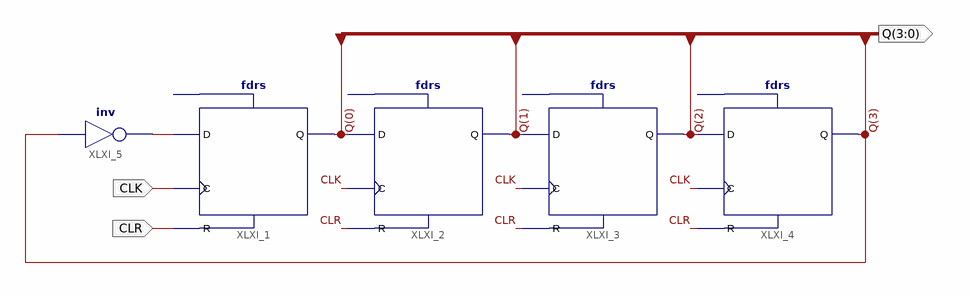
[diagram p0: schematic sheet 1]
// Xilinx ISE schematic Lab7_Ex8.sch (spartan3e) as structural Verilog: 5 symbols, 3 ports
module Lab7_Ex8 (
  input  CLK,
  input  CLR,
  output [3:0] Q
);

  wire XLXN_16;

  fdrs XLXI_1 (.C(CLK), .D(XLXN_16), .R(CLR), .Q(Q[0]));  // open: S
  fdrs XLXI_2 (.C(CLK), .D(Q[0]), .R(CLR), .Q(Q[1]));  // open: S
  fdrs XLXI_3 (.C(CLK), .D(Q[1]), .R(CLR), .Q(Q[2]));  // open: S
  fdrs XLXI_4 (.C(CLK), .D(Q[2]), .R(CLR), .Q(Q[3]));  // open: S
  not XLXI_5 (XLXN_16, Q[3]);
endmodule
